# EAGLE design TEMP(NC_I2C_V2) (EAGLE 6.5.0)
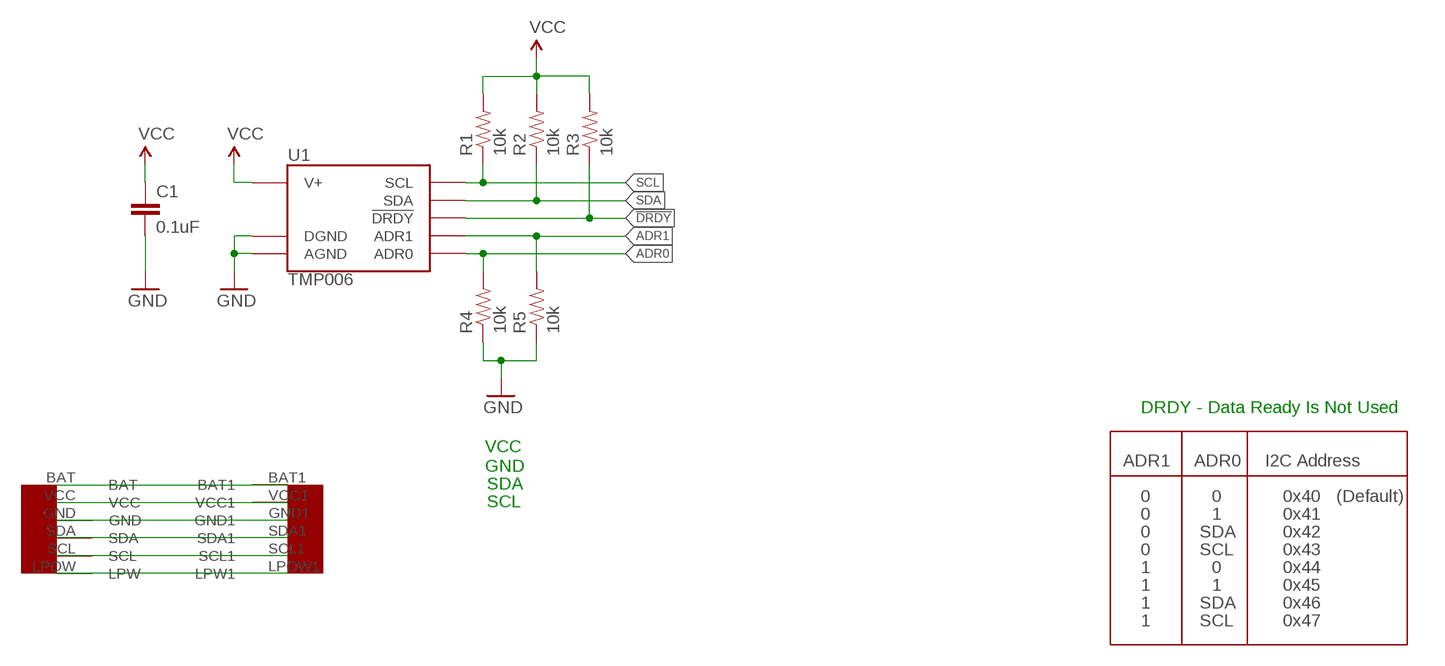
[diagram p0: schematic, sheet 1]

## Parts
C1  0.1uF  CAP0603-CAP  [0603-CAP]
R1  10k  RESISTOR0603-RES  [0603-RES]
R2  10k  RESISTOR0603-RES  [0603-RES]
R3  10k  RESISTOR0603-RES  [0603-RES]
R4  10k  RESISTOR0603-RES  [0603-RES]
R5  10k  RESISTOR0603-RES  [0603-RES]
U1  TMP006  [BGA8DS]
U$1  EZ-I2CHEADERV1  [EZ-I2CHEADERV1]

## Nets
!DRDY: R3.1 U1.C2(!DRDY)
ADR0: R4.2 U1.C1(ADR0)
ADR1: R5.2 U1.B1(ADR1)
GND: C1.2 R4.1 R5.1 U1.A1(DGND) U1.A2(AGND) U$1.GND U$1.GND1
N$1: U$1.BAT U$1.BAT1
N$2: U$1.LPOW1(LPW1) U$1.LPOW(LPW)
SCL: R1.1 U1.B3(SCL) U$1.SCL U$1.SCL1
SDA: R2.1 U1.C3(SDA) U$1.SDA U$1.SDA1
VCC: C1.1 R1.2 R2.2 R3.2 U1.A3(V+) U$1.VCC U$1.VCC1

## Notes on the sheet
- DRDY - Data Ready Is Not Used
- VCC
- ADR1 | ADR0 | I2C Address
- GND
- SDA
- 0 | 0 | 0x40 | (Default)
- SCL
- 0 | 1 | 0x41
- 0 | SDA | 0x42
- 0 | SCL | 0x43
- 1 | 0 | 0x44
- 1 | 1 | 0x45
- 1 | SDA | 0x46
- 1 | SCL | 0x47

## Library data of the parts
C1 = SparkFun-Capacitors:CAP: Capacitor Standard 0603 ceramic capacitor, and 0.1" leaded capacitor.
R1-R5 = SparkFun-Resistors:RESISTOR: Resistor Basic schematic elements and footprints for 0603, 1206, and PTH resistors.
U1 = SparkFun-DigitalIC:TMP006
U$1 = UniqueInteractionsLib:EZ-I2CHEADERV1

## Board
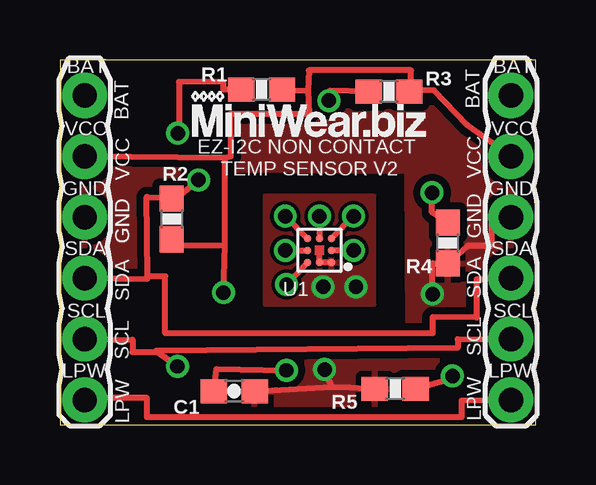
[diagram p1: board, top side]
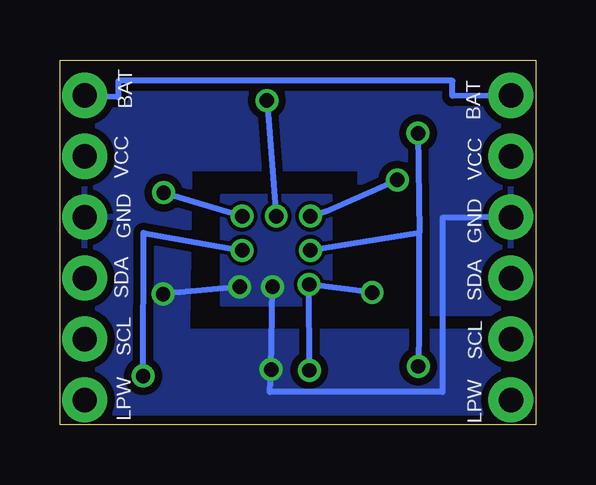
[diagram p2: board, bottom side, seen from below]

Size 19.84 x 15.21 mm. Coordinates in mm from the lower left corner, seen from the top.
Outline: 0,15.21 0,0 19.84,0 19.84,15.21 0,15.21
Copper layers (1*16): Top 0.0356mm / dielectric 1.5011mm / Bottom 0.0356mm
Design rules "oshParkPCBDesignRules": minimum track width 6mil, minimum drill 13mil, track to track 6mil, track to pad 6mil, pad to pad 6mil, via to via 6mil, smd to smd 6mil, copper to edge 15mil, drill to drill 6mil, minimum pad ring 7mil, minimum via ring 7mil, stop-mask expansion 3mil, vias tented up to drill 0mil, thermal gap 10mil

### Footprints (pad centres in the part's own frame; a part is rotated, then mirrored left to right if it is on the bottom)
0603-CAP = smd 1.1 x 1: 1 -0.85,0; 2 0.85,0
0603-RES = smd 1.1 x 1: 1 -0.85,0; 2 0.85,0
BGA8DS = smd 0.305 x 0.305: A1 0.5,-0.5; A2 0,-0.5; A3 -0.5,-0.5; B1 0.5,0; B3 -0.5,0; C1 0.5,0.5; C2 0,0.5; C3 -0.5,0.5
EZ-I2CHEADERV1 = drill 1.016 pad 1.88: BAT 0,-1.27; BAT1 17.78,-1.27; GND 0,-6.35; GND1 17.78,-6.35; LPOW 0,-13.97; LPOW1 17.78,-13.97; SCL 0,-11.43; SCL1 17.78,-11.43; SDA 0,-8.89; SDA1 17.78,-8.89; VCC 0,-3.81; VCC1 17.78,-3.81

### Placement (x,y rotation side)
C1  7.27,1.39 0 top
R1  8.41,13.98 0 top
R2  4.66,8.58 270 top
R3  13.72,13.89 0 top
R4  16.17,7.58 90 top
R5  13.98,1.5 0 top
U1  10.82,7.27 0 top
U$1  1.03,15 0 top
U$2  [LOGO2]  5.39,11.83 0 top

### Tracks (layer width: path | path; a pad name or v marks a point on that pad's centre or on a via)
!DRDY  (via drill 0.6 pad 0.25)
  Top 0.254: R3.1 11.25,13.93 11.22,13.89 v11.21,13.52 | v10.82,8.69 U1.C2
  Bottom 0.254: v11.21,13.52 v10.82,8.69
ADR0  (via drill 0.6 pad 0.25)
  Top 0.254: R4.2 15.52,8.85 v15.52,9.67 | v12.24,8.69 U1.C1
  Bottom 0.254: v15.52,9.67 v12.24,8.69
ADR1  (via drill 0.6 pad 0.25)
  Top 0.254: R5.2 16.26,1.9 v16.37,2.03 | v12.24,7.27 U1.B1
  Bottom 0.254: v16.37,2.03 16.35,8 v12.24,7.27
GND  (via drill 0.6 pad 0.25)
  Top 0.254: 11.35,1.57 12.1,1.55 R5.1 | C1.2 11.35,1.57 | 11.35,1.57 v11.03,2.3 | v10.97,5.75 10.97,6 | v15.54,5.45 15.54,6.73 R4.1 16.99,7.46 17.99,7.46 17.99,8.62 U$1.GND1 | U1.A1 U1.A2 10.82,7.21
  Bottom 0.254: v10.97,5.75 v11.03,2.3 11.08,1.36 3.89,1.36 3.89,8.62 U$1.GND | v12.34,5.75 v15.54,5.45
  pour Top: 8.53,4.98 8.53,9.56 13.11,9.56 13.11,4.98
  pour Top (isolate 0.305): 1.13,3.89 1.03,-1.07 20.18,-1.07 20.09,15.04 0.94,15.04 0.93,4.64 7.38,4.64 7.35,10.63 14.47,10.58 14.5,3.84
  pour Bottom (isolate 0.305): 1.13,3.89 1.03,-1.07 20.18,-1.07 20.08,15.13 0.93,15.13 0.93,4.64 7.38,4.64 7.31,10.65 14.46,10.67 14.53,3.91
  pour Bottom: 8.53,9.56 13.11,9.56 13.11,4.98 8.53,4.98
N$1
  Bottom 0.254: U$1.BAT 3.47,13.7 3.47,14.34 17.41,14.34 17.41,13.65 U$1.BAT1
N$2
  Top 0.254: U$1.LPOW1 16.74,1 16.74,0.31 3.63,0.31 3.63,1.11 2.19,1.11 U$1.LPOW
SCL  (via drill 0.6, 0.6 pad 0.25)
  Top 0.254: R1.1 6.82,13.98 6.82,14.28 4.96,14.3 4.97,12.69 v4.91,12.15 | v9.4,7.27 U1.B3 | 16.59,3.57 16.59,3.54 | U$1.SCL1 16.59,3.54 | 16.59,3.54 16.59,3.2 4.02,3.08 v4.9,2.43 4.06,3.03 3.03,3.03 3.03,3.54 U$1.SCL
  Bottom 0.254: v4.91,12.15 4.86,8 | 4.86,8 v9.4,7.27 | v4.9,2.43 4.86,3.52 4.86,8
SDA  (via drill 0.6 pad 0.25)
  Top 0.254: v5.77,10.2 4.96,9.53 R2.1 4.65,9.47 3.62,9.5 3.65,6.18 | v9.4,8.69 U1.C3 | 3.65,6.18 3.65,6.08 U$1.SDA | 17.37,6.06 17.37,4.47 15.54,4.49 15.54,3.81 4.39,3.81 4.39,6.18 3.65,6.18 | U$1.SDA1 17.37,6.06 | 17.37,6.06 17.65,6.06
  Bottom 0.254: v5.77,10.2 8.74,8.89 v9.4,8.69
VCC  (via drill 0.6 pad 0.25)
  Top 0.254: v6.82,5.51 6.88,7.46 | 6.88,7.46 6.88,11.13 | 6.88,11.13 7.13,11.19 7.12,12.97 10.38,12.98 10.34,13.93 | v9.45,5.85 U1.A3 | C1.1 6.53,2.32 v9.44,2.26 | R2.2 4.69,7.49 4.92,7.49 6.88,7.46 | R1.2 10.34,13.93 | 10.34,13.93 10.38,14.78 14.64,14.78 14.64,13.79 R3.2 14.6,13.98 15.6,13.93 16.97,12.5 U$1.VCC1 | U$1.VCC 6.88,11.13
  Bottom 0.254: v6.82,5.51 v9.45,5.85 v9.44,2.26

### Text on the board
tNames: EZ-I2C NON CONTACT / TEMP SENSOR V2